# EAGLE design lightprojectPCB (EAGLE 9.2.0)
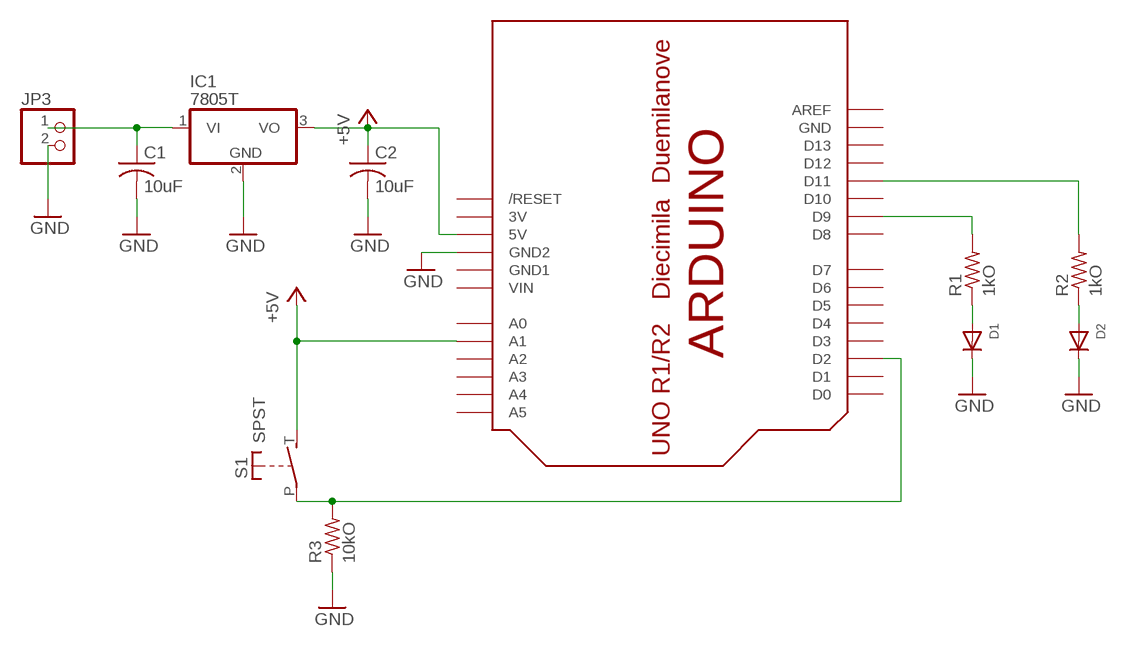
[diagram p0: schematic, sheet 1]

## Parts
C1  10uF  C-USC0805  [C0805]
C2  10uF  C-USC0805  [C0805]
D1  DIODESMA  [SMADIODE]
D2  DIODESMA  [SMADIODE]
IC1  7805T  [TO220H]
JP3  PINHD-1X2  [1X02]
R1  1kO  R-US_M0805  [M0805]
R2  1kO  R-US_M0805  [M0805]
R3  10kO  R-US_M0805  [M0805]
S1  SPST  [JUDCOSPST]
U$1  ARDUINO-BPLACE  [ARDUINO-BPLACE]

## Nets
+5V: C2.1 IC1.3(VO) S1.T(S) U$1.5V U$1.A1
GND: C1.2 C2.2 D1.C D2.C IC1.2(GND) JP3.2 R3.1 U$1.GND2
N$1: R1.2 U$1.D9
N$2: C1.1 IC1.1(VI) JP3.1
N$3: D2.A R2.1
N$4: D1.A R1.1
N$5: R3.2 S1.P U$1.D2
N$6: R2.2 U$1.D11
Unconnected: U$1.A0 U$1.A2 U$1.A3 U$1.A4 U$1.A5 U$1.AREF U$1.D0 U$1.D1 U$1.D3 U$1.D4 U$1.D5 U$1.D6 U$1.D7 U$1.D8 U$1.D10 U$1.D12 U$1.D13 U$1.RESET(/RESET)

## Power pins joined to a net without a drawn wire
3V: U$1.3V
GND: U$1.GND
GND1: U$1.GND1
VIN: U$1.VIN

## Library data of the parts
C1 C2 = adafruit:C-US: CAPACITOR, American symbol
D1 D2 = adafruit:DIODE: Diode SMADIODE - SMA Surface Mount Package 20V 1A Schottky Diode Digikey: 641-1014-6-ND DO-1N4148 - Through Hole Small Current Diode SOD-123 20V 1 A (.5mV Vf) Schottky Diode - Digikey: MBRX120TPMSCT-ND SOD-323 10V 570mA (.38mV Vf, 3ns) Schottky Diode - Digikey: ZLLS410CT-ND SOD-523 30V 30mA Schottky Diode (RB751S-40TE61) - Digikey: RB751S-40TE61CT-ND SOT23-R/W - SOT23 Package (R = Solder Paste/Reflow Ovens, W = Hand-Soldering) BAT54Film 40V 300mA - Digikey: 497-7162-1-ND
IC1 = adafruit:78*: Positive VOLTAGE REGULATOR Added bigger pads to the TO-92 package
JP3 = pinhead:PINHD-1X2: PIN HEADER
R1-R3 = adafruit:R-US_: RESISTOR, American symbol
S1 = adafruit:SPST: Judco 50-0015-00
U$1 = adafruit:ARDUINO: Arduino Diecimila/Duemilanove Make a shield with ease, this package has all the named pins as well as the two mounting drill holes and an outline of the USB and DC power connector. The outline is on the DIMENSION layer, so if your board house uses it they will cut the outline to match. http://www.ladyada.net/library/pcb/eaglelibrary.html

## Board
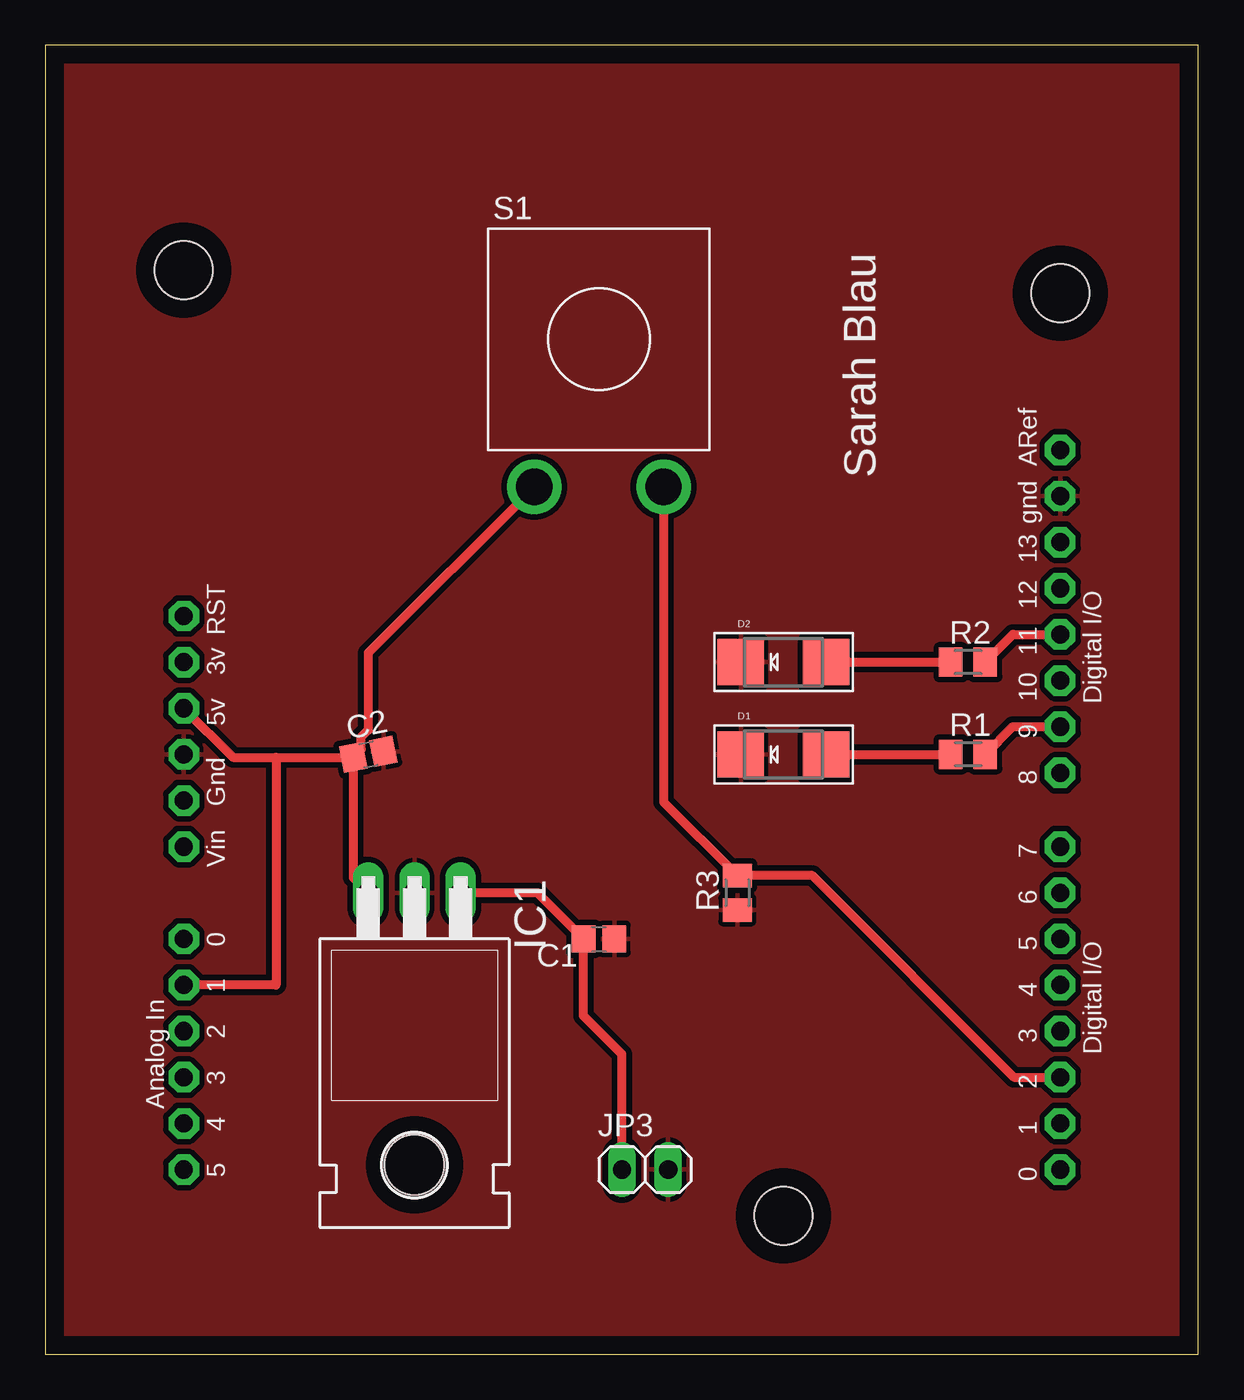
[diagram p1: board, top side]
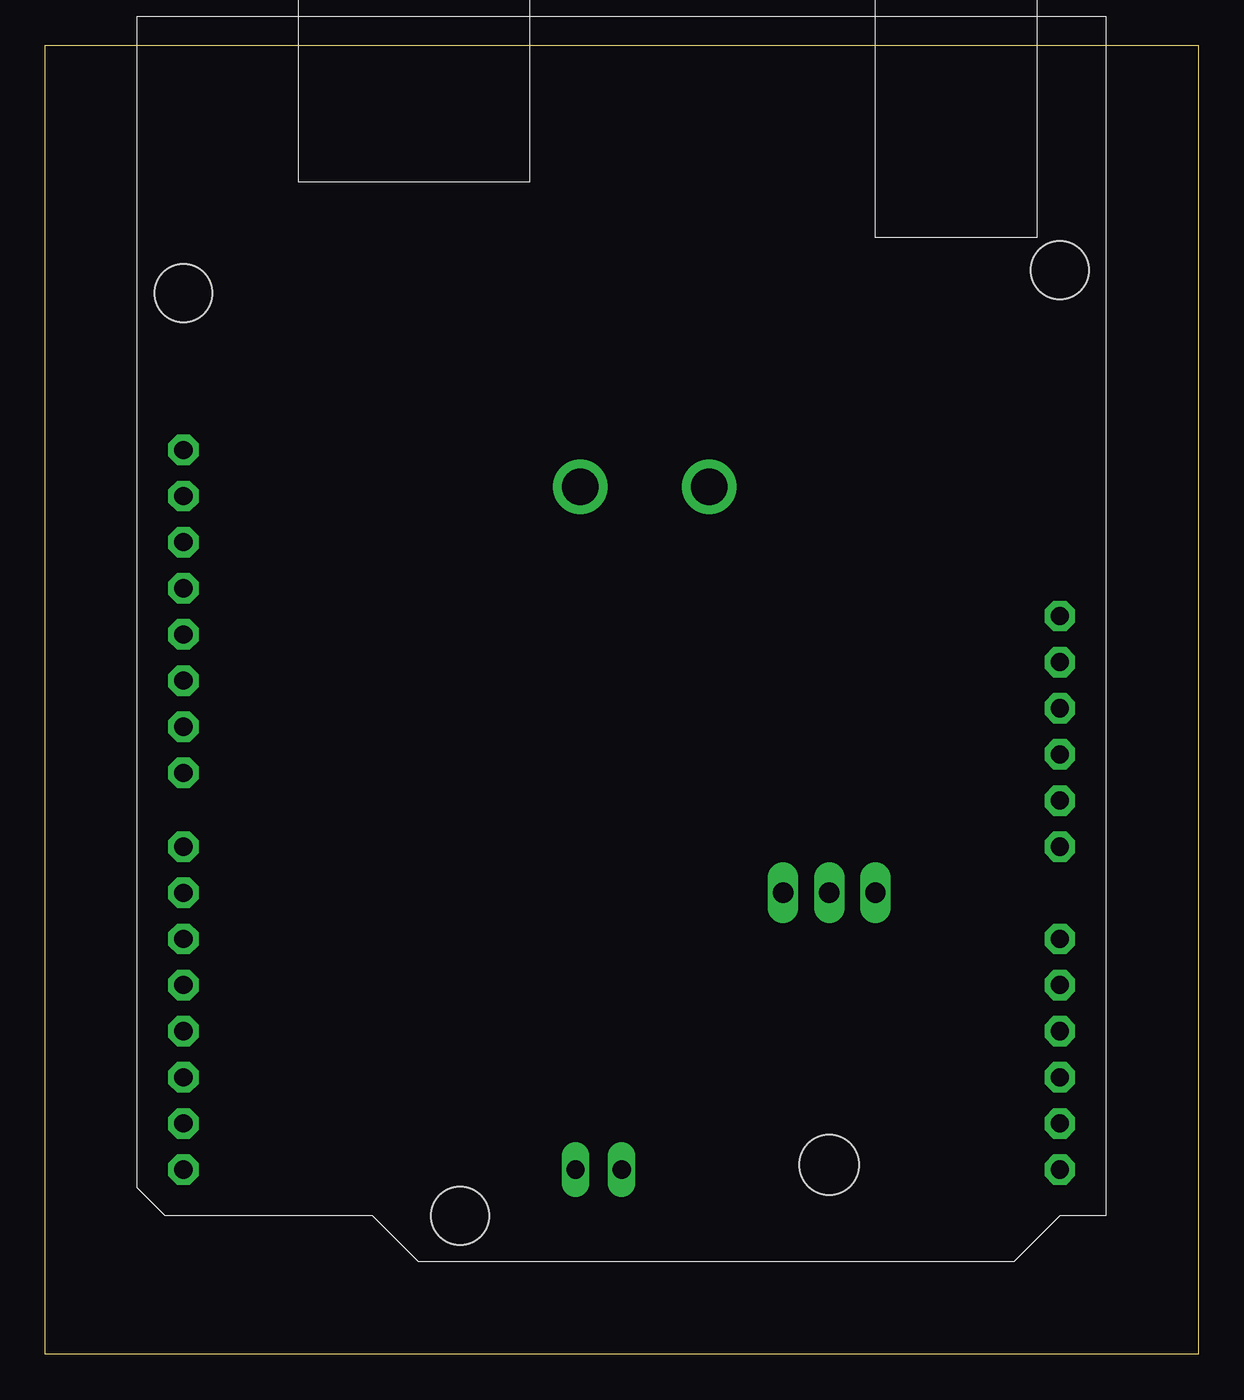
[diagram p2: board, bottom side, seen from below]

Size 63.48 x 72.06 mm. Coordinates in mm from the lower left corner, seen from the top.
Outline: 0,0 63.48,0 63.48,72.06 0,72.06 0,0
Copper layers (1*16): Top 0.035mm / dielectric 1.5mm / Bottom 0.035mm
Design rules "default *": minimum track width 20mil, minimum drill 0.35mm, track to track 12mil, track to pad 6mil, pad to pad 6mil, via to via 6mil, smd to smd 6mil, copper to edge 40mil, drill to drill 6mil, minimum pad ring 10mil, minimum via ring 8mil, stop-mask expansion 4mil, vias tented up to drill 0mil, thermal gap 10mil

### Footprints (pad centres in the part's own frame; a part is rotated, then mirrored left to right if it is on the bottom)
C0805 = smd 1.3 x 1.5: 1 -0.85,0; 2 0.85,0
SMADIODE = smd 2.54 x 2.54: A 2.349,0; C -2.349,0
TO220H = drill 1.118 long: 1 -2.54,-10.16; 2 0,-10.16; 3 2.54,-10.16 | hole 3.302: 0,4.826
1X02 = drill 1.016 long: 1 -1.27,0; 2 1.27,0
M0805 = smd 1.3 x 1.6: 1 -0.95,0; 2 0.95,0
JUDCOSPST = drill 2: P 3.556,-8.128; T -3.556,-8.128
ARDUINO-BPLACE = drill 1 pad 1.676 octagon: 3V 35.56,2.54; 5V 38.1,2.54; A0 50.8,2.54; A1 53.34,2.54; A2 55.88,2.54; A3 58.42,2.54; A4 60.96,2.54; A5 63.5,2.54; AREF 23.876,50.8; D0 63.5,50.8; D1 60.96,50.8; D2 58.42,50.8; D3 55.88,50.8; D4 53.34,50.8; D5 50.8,50.8; D6 48.26,50.8; D7 45.72,50.8; D8 41.656,50.8; D9 39.116,50.8; D10 36.576,50.8; D11 34.036,50.8; D12 31.496,50.8; D13 28.956,50.8; GND 26.416,50.8; GND1 43.18,2.54; GND2 40.64,2.54; RESET 33.02,2.54; VIN 45.72,2.54 | hole 3.2: 15.24,50.8; 66.04,35.56; 13.97,2.54

### Placement (x,y rotation side)
C1  30.48,22.86 0 top
C2  17.78,33.02 11.3 top
D1  40.64,33.02 0 top
D2  40.64,38.1 0 top
IC1  20.32,15.24 180 top
JP3  33.02,10.16 0 top
R1  50.8,33.02 0 top
R2  50.8,38.1 0 top
R3  38.1,25.4 90 top
S1  30.48,55.88 0 top
U$1  5.08,73.66 270 top

### Tracks (layer width: path | path; a pad name or v marks a point on that pad's centre or on a via)
+5V
  Top 0.508: C2.1 17.4,33.3 17.4,33.97 17.78,34.36 17.78,38.61 S1.T | 12.7,32.85 10.33,32.85 U$1.5V | 12.7,32.85 C2.1 | C2.1 16.95,26.23 IC1.3 | 12.7,32.85 12.7,20.32 U$1.A1
GND
  pour Top: 2.54,96.52 157.48,96.52 157.48,0 -2.54,0 -2.54,91.44
N$1
  Top 0.508: R1.2 53.27,34.54 U$1.D9
N$2
  Top 0.508: JP3.1 31.75,16.51 29.63,18.63 C1.1 27.09,25.4 IC1.1
N$3
  Top 0.508: D2.A R2.1
N$4
  Top 0.508: D1.A R1.1
N$5
  Top 0.508: S1.P 34.04,30.41 R3.2 42.23,26.35 53.34,15.24 U$1.D2
N$6
  Top 0.508: R2.2 53.27,39.62 U$1.D11

### Text on the board
tSilk: Sarah Blau